# EAGLE design Schematic (EAGLE 7.2.0)
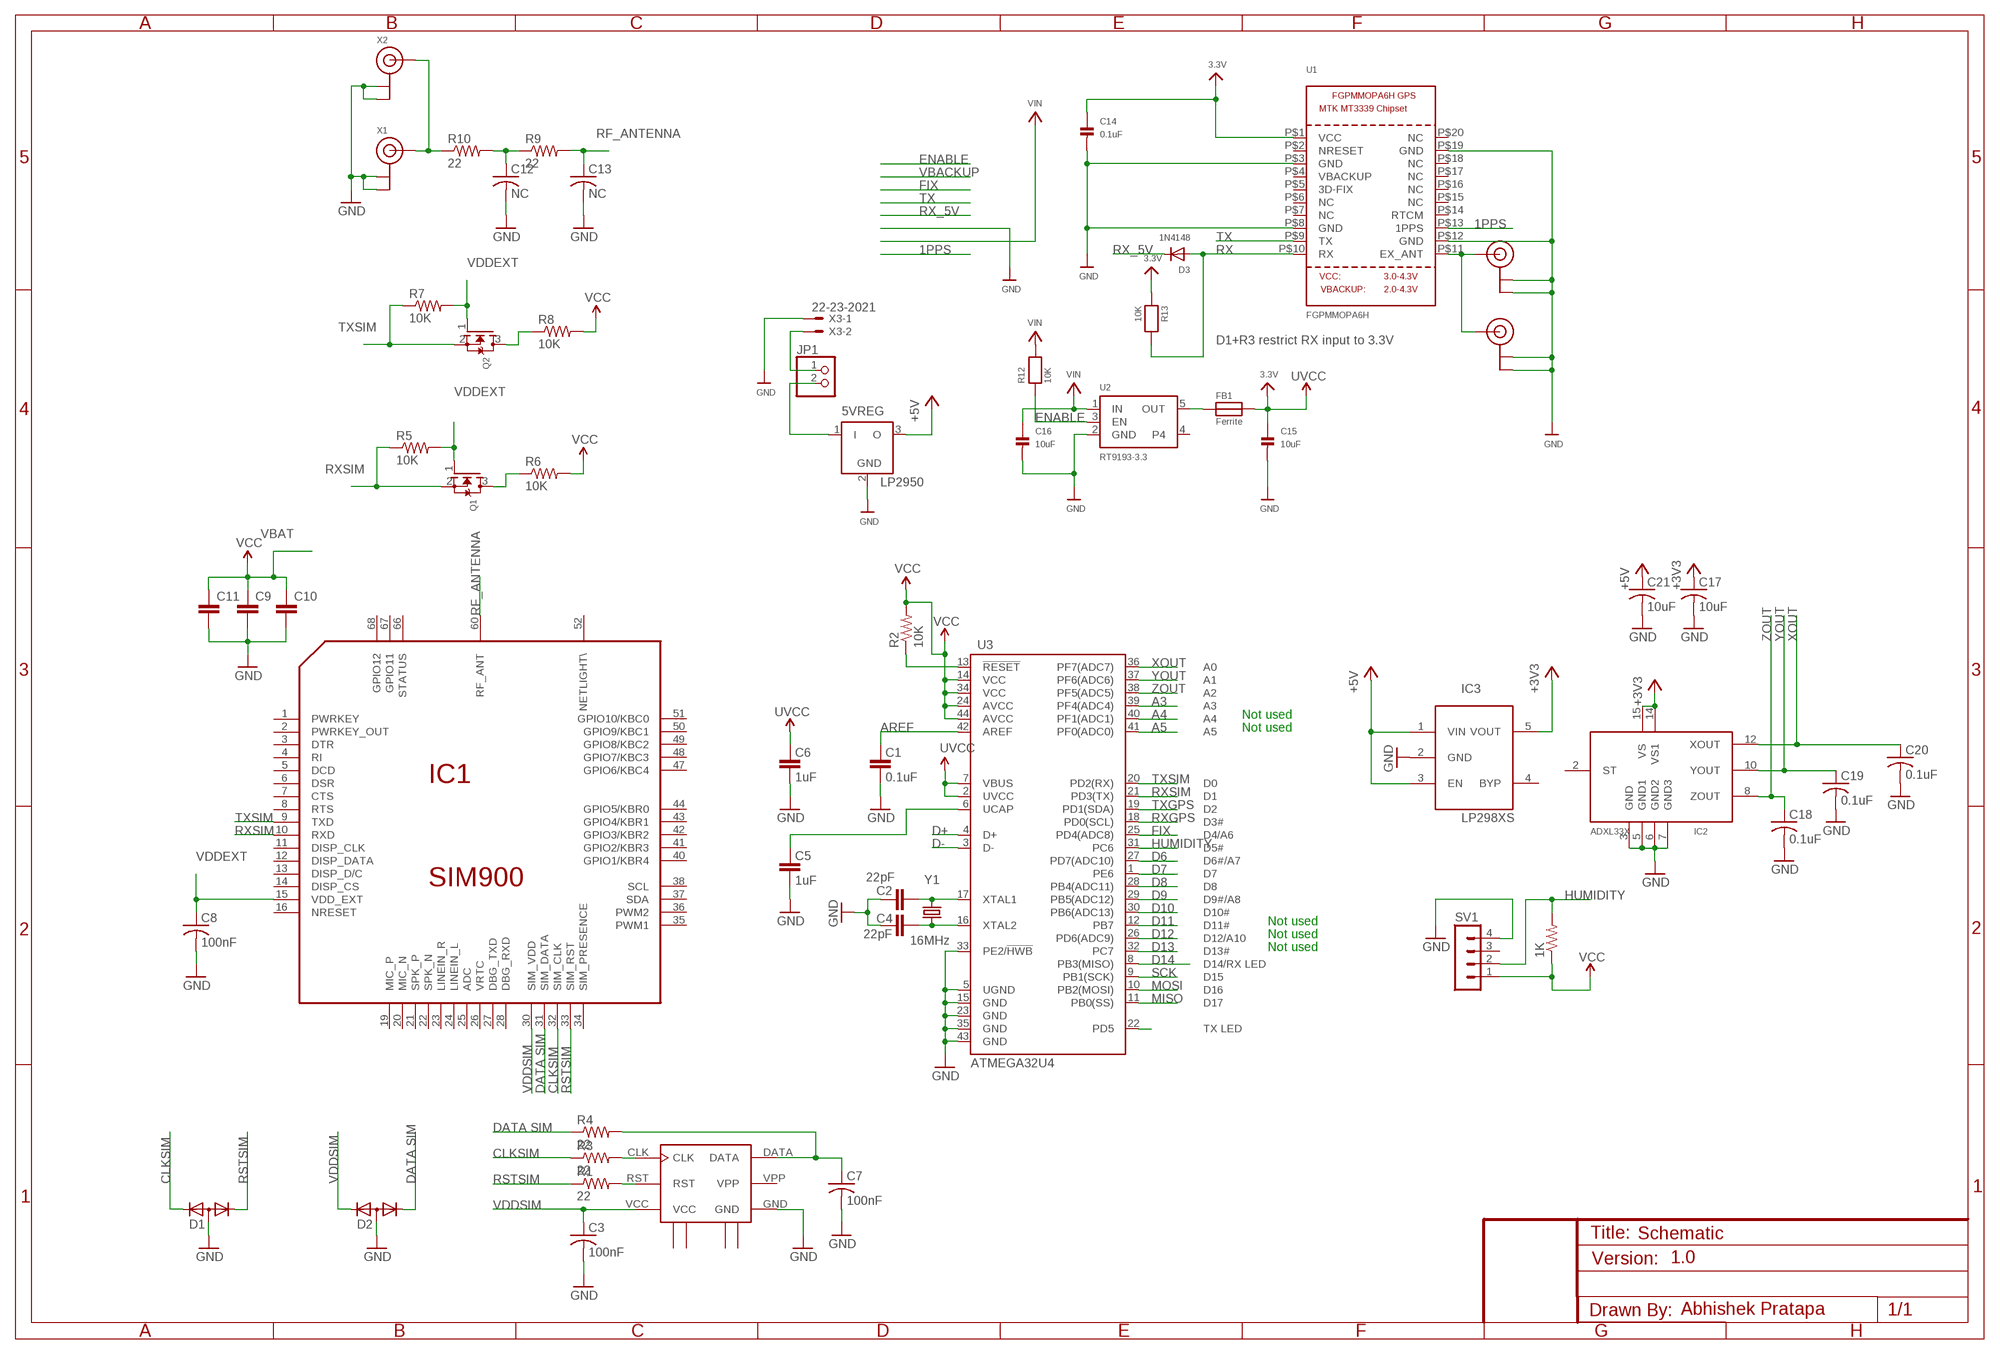
[diagram p0: schematic, sheet 1]

## Parts
1K  R-US_M0805  [M0805]
5VREG  LP2950  [DPACK]
C1  0.1uF  CAP0603-CAP  [0603-CAP]
C2  22pF  CAP0603-CAP  [0603-CAP]
C3  100nF  C-USC0805  [C0805]
C4  22pF  CAP0603-CAP  [0603-CAP]
C5  1uF  CAP0603-CAP  [0603-CAP]
C6  1uF  CAP0603-CAP  [0603-CAP]
C7  100nF  C-USC0805  [C0805]
C8  100nF  C-USC0805  [C0805]
C9  C-EUC0805  [C0805]
C10  C-EUC0805  [C0805]
C11  C-EUC0805  [C0805]
C12  NC  C-USC0805  [C0805]
C13  NC  C-USC0805  [C0805]
C14  0.1uF  CAP_CERAMIC0805  [0805]
C15  10uF  CAP_CERAMIC0805  [0805]
C16  10uF  CAP_CERAMIC0805  [0805]
C17  10uF  C-USC0805K  [C0805K]
C18  0.1uF  C-USC0805K  [C0805K]
C19  0.1uF  C-USC0805K  [C0805K]
C20  0.1uF  C-USC0805K  [C0805K]
C21  10uF  C-USC0805K  [C0805K]
D1  DIODE-2CA|ACSOT23  [SOT23]
D2  DIODE-2CA|ACSOT23  [SOT23]
D3  1N4148  DIODESOD-323F  [SOD-323F]
FB1  Ferrite  FERRITE0805  [0805]
IC1  SIM900  [SIM900]
IC2  ADXL33X  [16LCSP]
IC3  LP298XS  [SOT23-5L]
JP1  PINHD-1X2  [1X02]
Q1  MOSFET-NREFLOW  [SOT23]
Q2  MOSFET-NREFLOW  [SOT23]
R1  22  R-US_M0805  [M0805]
R2  10K  RESISTOR0603-RES  [0603-RES]
R3  22  R-US_M0805  [M0805]
R4  22  R-US_M0805  [M0805]
R5  10K  R-US_M0805  [M0805]
R6  10K  R-US_M0805  [M0805]
R7  10K  R-US_M0805  [M0805]
R8  10K  R-US_M0805  [M0805]
R9  22  R-US_R0805  [R0805]
R10  22  R-US_R0805  [R0805]
R12  10K  RESISTOR0805  [0805]
R13  10K  RESISTOR0805  [0805]
SV1  MA04-1  [MA04-1]
U1  FGPMMOPA6H  GPS_FGPMMOPA6H  [FGPMMOPA6H]
U2  RT9193-3.3  VREG_SOT23-5  [SOT23-5]
U3  ATMEGA32U4  ATMEGA32U4OUTFAKES  [QFN-44-NOPAD_1:1-OUTFAKES]
U$1  SCU-W0822XR-06  [SCU-W0822XR-06]
U$8  U.FL  [U.FL]
U$20  U.FL  [U.FL]
X1  ANTENNA_U.FL  [U.FL]
X2  ANTENNA_U.FL  [U.FL]
X3  22-23-2021  [22-23-2021]
Y1  16MHz  CRYSTAL5X3  [CRYSTAL-SMD-5X3]

## Nets
1PPS: U1.P$13(1PPS)
3.3V: 1K.1 C14.1 C15.1 FB1.2 R13.1 SV1.1 U1.P$1(VCC) ; supply symbol labelled UVCC, VCC
+3V3: C17.1 IC2.14(VS1) IC2.15(VS) IC3.5(VOUT)
+5V: 5VREG.3(O) C21.1 IC3.1(VIN) IC3.3(EN)
A3: U3.39(PF4(ADC4))
A4: U3.40(PF1(ADC1))
A5: U3.41(PF0(ADC0))
AREF: C1.2 U3.42(AREF)
CLKSIM: D1.2(K2) IC1.32(SIM_CLK) R3.1
D6: U3.27(PD7(ADC10))
D7: U3.1(PE6)
D8: U3.28(PB4(ADC11))
D9: U3.29(PB5(ADC12))
D10: U3.30(PB6(ADC13))
D11: U3.12(PB7)
D12: U3.26(PD6(ADC9))
D13: U3.32(PC7)
D14: U3.8(PB3(MISO))
D+: U3.4(D+)
D-: U3.3(D-)
DATASIM: D2.1(K1) IC1.31(SIM_DATA) R4.1
ENABLE: R12.1 U2.3(EN)
FIX: U3.25(PD4(ADC8))
GND [vcc]: 5VREG.2(GND) C1.1 C2.2 C3.2 C4.2 C5.1 C6.1 C7.2 C8.2 C9.2 C10.2 C11.2 C12.2 C13.2 C14.2 C15.2 C16.2 C17.2 C18.2 C19.2 C20.2 C21.2 D1.3(A) D2.3(A) IC2.3(GND) IC2.5(GND1) IC2.6(GND2) IC2.7(GND3) IC3.2(GND) SV1.4 U1.P$3(GND) U1.P$8(GND) U1.P$12(GND) U1.P$19(GND) U2.2(GND) U3.5(UGND) U3.15(GND) U3.23(GND) U3.33(PE2/!HWB) U3.35(GND) U3.43(GND) U$1.GND U$8.P$1(GND) U$8.P$2(GND) U$20.P$1(GND) U$20.P$2(GND) X1.1(GND) X1.2(GND) X2.1(GND) X2.2(GND) X3.1
HUMIDITY: 1K.2 SV1.2 U3.31(PC6)
MISO: U3.11(PB0(SS))
MOSI: U3.10(PB2(MOSI))
N$1: C4.1 U3.16(XTAL2) Y1.1
N$2: C2.1 U3.17(XTAL1) Y1.3
N$3: R1.2 U$1.RST
N$4: C5.2 U3.6(UCAP)
N$5: R3.2 U$1.CLK
N$6: C7.1 R4.2 U$1.DATA
N$7: R10.1 X1.3(SIGNAL) X2.3(SIGNAL)
N$8: C12.1 R9.1 R10.2
N$9: Q1.3(D) R6.1
N$10: Q2.3(D) R8.1
N$11: 5VREG.1(I) JP1.2
N$12: FB1.1 U2.5(OUT)
N$13: U1.P$11(EX_ANT) U$8.P$3(SIGNAL) U$20.P$3(SIGNAL)
N$14: JP1.1 X3.2
RESET: R2.1 U3.13(!RESET)
RF_ANTENNA: C13.1 IC1.60(RF_ANT) R9.2
RSTSIM: D1.1(K1) IC1.33(SIM_RST) R1.1
RX: D3.A R13.2 U1.P$10(RX)
RX_5V: D3.C U3.18(PD0(SCL))
RXSIM: IC1.10(RXD) Q1.2(S) R5.1 U3.21(PD3(TX))
SCK: U3.9(PB1(SCK))
TX: U1.P$9(TX) U3.19(PD1(SDA))
TXLED: U3.22(PD5)
TXSIM: IC1.9(TXD) Q2.2(S) R7.1 U3.20(PD2(RX))
UVCC: C6.2 U3.2(UVCC) U3.7(VBUS)
VCCSIM: C3.1 D2.2(K2) IC1.30(SIM_VDD) U$1.VCC
VDDEXT: C8.1 IC1.15(VDD_EXT) Q1.1(G) Q2.1(G) R5.2 R7.2
VIN: C9.1 C10.1 C11.1 C16.1 R2.2 R6.2 R8.2 R12.2 U2.1(IN) U3.14(VCC) U3.24(AVCC) U3.34(VCC) U3.44(AVCC) ; supply symbol labelled VCC
XOUT: C20.1 IC2.12(XOUT) U3.36(PF7(ADC7))
YOUT: C19.1 IC2.10(YOUT) U3.37(PF6(ADC6))
ZOUT: C18.1 IC2.8(ZOUT) U3.38(PF5(ADC5))
Unconnected: IC1.1(PWRKEY) IC1.2(PWRKEY_OUT) IC1.3(DTR) IC1.4(RI) IC1.5(DCD) IC1.6(DSR) IC1.7(CTS) IC1.8(RTS) IC1.11(DISP_CLK) IC1.12(DISP_DATA) IC1.13(DISP_D/C) IC1.14(DISP_CS) IC1.16(NRESET) IC1.19(MIC_P) IC1.20(MIC_N) IC1.21(SPK_P) IC1.22(SPK_N) IC1.23(LINEIN_R) IC1.24(LINEIN_L) IC1.25(ADC) IC1.26(VRTC) IC1.27(DBG_TXD) IC1.28(DBG_RXD) IC1.34(SIM_PRESENCE) IC1.35(PWM1) IC1.36(PWM2) IC1.37(SDA) IC1.38(SCL) IC1.40(GPIO1/KBR4) IC1.41(GPIO2/KBR3) IC1.42(GPIO3/KBR2) IC1.43(GPIO4/KBR1) IC1.44(GPIO5/KBR0) IC1.47(GPIO6/KBC4) IC1.48(GPIO7/KBC3) IC1.49(GPIO8/KBC2) IC1.50(GPIO9/KBC1) IC1.51(GPIO10/KBC0) IC1.52(NETLIGHT\) IC1.66(STATUS) IC1.67(GPIO11) IC1.68(GPIO12) IC2.2(ST) IC3.4(BYP) SV1.3 U1.P$2(NRESET) U1.P$4(VBACKUP) U1.P$5(3D-FIX) U1.P$6(NC) U1.P$7(NC) U1.P$14(RTCM) U1.P$15(NC) U1.P$16(NC) U1.P$17(NC) U1.P$18(NC) U1.P$20(NC) U2.4

## Notes on the sheet
- D1+R3 restrict RX input to 3.3V
- VBAT
- Not used
- Not used
- TXGPS
- RXGPS
- Not used
- Not used
- Not used
- VDDSIM | DATA SIM | CLKSIM | RSTSIM
- DATA SIM
- CLKSIM
- CLKSIM | RSTSIM | VDDSIM | DATA SIM | RSTSIM
- VDDSIM
- 1.0
- Abhishek Pratapa

## Power pins joined to a net without a drawn wire
GND: IC1.17(GND) IC1.18(GND) IC1.29(GND) IC1.39(GND) IC1.45(GND) IC1.46(GND) IC1.53(GND) IC1.54(GND) IC1.58(GND) IC1.59(GND) IC1.61(GND) IC1.62(GND) IC1.63(GND) IC1.64(GND) IC1.65(GND) U$1.GND_1(GND1) U$1.GND_2(GND2) U$1.GND_3(GND3)
GND4: U$1.GND_4(GND4)
VBAT: IC1.55(VBAT) IC1.56(VBAT) IC1.57(VBAT)
VPP: U$1.VPP

## Library data of the parts
1K R1 R3-R10 = adafruit:R-US_: RESISTOR, American symbol
5VREG = linear:LP2950: 100 mA, Low Power Low Dropout Voltage Regulator Source: http://www.onsemi.com/pub/Collateral/LP2950-D.PDF
C1 C2 C4-C6 = SparkFun:CAP: Capacitor Standard 0603 ceramic capacitor, and 0.1" leaded capacitor.
C3 C7 C8 C12 C13 C17-C21 = adafruit:C-US: CAPACITOR, American symbol
C9-C11 = rcl:C-EU: CAPACITOR, European symbol
C14-C16 = microbuilder:CAP_CERAMIC: Ceramic Capacitors 0402 - 0402 Surface Mount Capacitors 16pF 50V 5% [Digikey: 445-4899-2-ND] 18pF 50V 5% [Digikey: 490-1281-2-ND] 22pF 50V 5% [Digikey: 490-1283-2-ND] 68pF 50V 5% [Digikey: 490-1289-2-ND] 0.1uF 10V 10% [Digikey: 490-1318-2-ND] 1.0uF 6.3V 10% [Digikey: 490-1320-2-ND] 0603 - 0603 Surface Mount Capacitors 16 pF 50V 5% [Digikey: 445-5051-2-ND] 22 pF 50V [Digikey: PCC220ACVTR-ND] 33 pF 50V 5% [Digikey: 490-1415-1-ND] 56pF 50V 5% [Digikey: 490-1421-1-ND] 220pF 50V 5% [Digikey: 445-1285-1-ND] 680 pF 50V 2200 pF 50V 5% C0G [Digikey: 445-1297-1-ND] 5600 pF 100V 5% X7R [Digikey: 478-3711-1-ND] 0.1 µF 25V 10% [Digikey: PCC2277TR-ND] 0.22 µF 16V 10% X7R [Digikey: 445-1318-1-ND] 1.0 µF 25V 10% [Digikey: 445-5146-2-ND] 0603 - RF Specific 3pF 250V +/-0.1pF RF [Digikey: 712-1347-1-ND] 18 pF 250V 5% [Digikey: 478-3505-1-ND or 712-1322-1-ND] 56 pF 250V 5% C0G RF [Digikey: 490-4867-1-ND] 68 pF 250V RF [Digikey: 490-4868-1-ND] 0805 - 0805 Surface Mount Capacitors 220 pF 250V 2% RF Ceramic Capacitor [Digikey: 712-1398-1-ND] 1000 pF 50V 2% NP0 Ceramic Capacitor [Digikey: 478-3760-1-ND] 0.1 µF 25V 10% Ceramic Capacitor [Digikey: PCC1828TR-ND] 1.0 µF 16V 10% Ceramic Capacitor[Digikey: 490-1691-2-ND] 10.0 µF 10V 10% Ceramic Capacitor[Digikey: 709-1228-1-ND] 10.0 uF 16V 10% Ceramic Capacitor [Digikey: 478-5165-2-ND] 47 uF 6.3V 20% Ceramic Capacitor [Digikey: 587-1779-1-ND or 399-5506-1-ND] 1206 - 1206 Surface Mount Capacitors 47uF 10V 20% Ceramic Capacitor [Digikey: 490-5528-1-ND or 399-5508-1-ND or 445-6010-1-ND] 100uF 6.3V -20%, +80% Y5V Ceramic Capacitor (Digikey: 490-4512-1-ND, Mouser: 81-GRM31CF50J107ZE1L)
D1 D2 = diode:DIODE-2CA|AC: Dual DIODE Cathode-Anode|Anode-Cathode
D3 = adafruit:DIODE: Diode SMADIODE - SMA Surface Mount Package 20V 1A Schottky Diode Digikey: 641-1014-6-ND DO-1N4148 - Through Hole Small Current Diode SOD-123 20V 1 A (.5mV Vf) Schottky Diode - Digikey: MBRX120TPMSCT-ND SOD-323 10V 570mA (.38mV Vf, 3ns) Schottky Diode - Digikey: ZLLS410CT-ND SOD-523 30V 30mA Schottky Diode (RB751S-40TE61) - Digikey: RB751S-40TE61CT-ND SOT23-R/W - SOT23 Package (R = Solder Paste/Reflow Ovens, W = Hand-Soldering) BAT54Film 40V 300mA - Digikey: 497-7162-1-ND
FB1 = microbuilder:FERRITE: Ferrite Bead 0603 MMZ1608B121C - 120 Ohm, 600mA Ferrite Chip - Digikey: 445-2164-1-ND BK1608HW121-T - 120 Ohm, 600mA Ferrite Chip - Digikey: 587-1876-2-ND
IC1 = sim900:SIM900
IC2 = adafruit:ADXL33X
IC3 = adafruit:LP298X
JP1 = pinhead:PINHD-1X2: PIN HEADER
Q1 Q2 = adafruit:MOSFET-N: N-Channel Mosfet 2N7002E - 60V 260mA SOT23 [Digikey: 2N7002ET1GOSTR-ND] - REEL BSH103 - 30V 850mA SOT23 [Digikey: 568-5013-1-ND]
R2 = SparkFun:RESISTOR: Resistor Basic schematic elements and footprints for 0603, 1206, and PTH resistors.
R12 R13 = microbuilder:RESISTOR: Resistors 0402 - 0402 Surface Mount Package 22 Ohm 1% 1/16W [Digikey: 311-22.0LRTR-ND] 33 Ohm 5% 1/16W 1.0K 5% 1/16W 1.5K 5% 1/16W 2.0K 1% 1/16W 10.0K 1% 1/16W [Digikey: 311-10.0KLRTR-ND] 10.0K 5% 1/16W [Digikey: RMCF0402JT10K0TR-ND] 12.1K 1% 1/16W [Digikey: 311-22.0LRTR-ND] 100.0K 5% 1/16W 0603 - 0603 Surface Mount Package 0 Ohm 1/10 Watt 1% Resistor 15 Ohm 1/10 Watt 1% Resistor 33 Ohm 1/10 Watt 1% Resistor 49.9 Ohm 1/10 Watt 1% Resistor 100 Ohm 1/10 Watt 1% Resistor 150 Ohm 1/10 Watt 1% Resistor 240 Ohm 1/10 Watt 1% Resistor 390 Ohm 1/10 Watt 1% Resistor 560 Ohm 1/10 Watt 1% Resistor 680 Ohm 1/10 Watt 1% Resistor 750 Ohm 1/10 Watt 1% Resistor 1.0K Ohm 1/10 Watt 1% Resistor 1.5K Ohm 1/10 Watt 1% Resistor 2.0K Ohm 1/10 Watt 1% Resistor 2.2K Ohm 1/10 Watt 1% Resistor 3.3K Ohm 1/10 Watt 1% Resistor 4.7K Ohm 1/10 Watt 1% Resistor 10.0K Ohm 1/10 Watt 1% Resistor 12.0K Ohm 1/10 Watt 1% Resistor 12.1K Ohm 1/10 Watt 1% Resistor 20.0K Ohm 1/10 Watt 1% Resistor 33.0K Ohm 1/10 Watt 1% Resistor 100.0K Ohm 1/10 Watt 1% Resistor 0805 - 0805 Surface Mount Package 0 Ohm 1/8 Watt 1% Resistor 33 Ohm 1/8 Watt 1% Resistor 100 Ohm 1/8 Watt 1% Resistor 150 Ohm 1/8 Watt 1% Resistor 200 Ohm 1/8 Watt 1% Resistor 240 Ohm 1/8 Watt 1% Resistor 330 Ohm 1/8 Watt 1% Resistor 390 Ohm 1/8 Watt 1% Resistor 470 Ohm 1/8 Watt 1% Resistor 1.0K Ohm 1/8 Watt 1% Resistor 1.5K Ohm 1/8 Watt 1% Resistor 2.0K Ohm 1/8 Watt 1% Resistor 4.7K Ohm 1/8 Watt 1% Resistor 5.1K Ohm 1/8 Watt 1% Resistor 5.6K Ohm 1/8 Watt 1% Resistor 10.0K Ohm 1/8 Watt 1% Resistor 22.0K Ohm 1/8 Watt 1% Resistor 33.0K Ohm 1/8 Watt 1% Resistor 100K Ohm 1/8 Watt 1% Resistor 1206 - 1206 Surface Mount Package 2012 - 2010 Surface Mount Package 0.11 Ohm 1/2 Watt 1% Resistor - Digikey: RHM.11UCT-ND
SV1 = con-lstb:MA04-1: PIN HEADER; OC_FARNELL: unknown; OC_NEWARK: unknown
U1 = microbuilder:GPS_FGPMMOPA6H: GPS Module - MTK MT3339 Chipset, -165dBm sensitivity, 22 channels, 10Hz, auto-select external antenna options
U2 = microbuilder:VREG_SOT23-5: SOT23-5 Fixed Voltage Regulators To better organise some of the SOT23-5 fixed voltage regulators in this library, this new part was created. Part Current Out V Out V In V Dropout Digikey Part No. ADP121 150mA 3.3V 3.4-5.5V 0.09V @ 150mA ADP121-AUJZ33R7CT-ND ADP121 150mA 3.0V 3.1-5.5V 0.09V @ 150mA ADP121-AUJZ30R7CT-ND ADP122 300mA 3.3V 3.4-5.5V 0.085V @ 300mA ADP122AUJZ-3.3-R7CT-ND ADP1712 300mA 3.3V 3.5-5.5V 0.17V @ 300mA ADP1712AUJZ-3.3-R7TR-ND AP7311 (Low Cost) 150mA 3.3V 3.5-6V 0.15V @ 150mA AP7311-33WG-7DICT-ND LD39015M18R 150mA 1.8V 1.9V-5.5V 0.08V @ 100mA 497-6977-1-ND MCP1824T-3302E/OT 300mA 3.3V 3.5V-6V 0.2V @ 300mA MCP1824T-3302E/OTCT-ND MIC5205-2.5YM5 TR 150mA 2.5V 2.7-16V 0.165V @ 150mA 576-1257-2-ND MIC5205-3.0YM5 TR 150mA 3.0V 3.2V-16V 0.165V @ 150mA 576-1258-2-ND MIC5205-3.3YM5 TR 150mA 3.3V 3.5V-16V 0.165V @ 150mA 576-1259-2-ND TPS780330220 150mA 3.3V+2.2V 3.6-5.5V 250mV Max 296-23332-1-ND TDA3663/N1,135 100mA 3.3V 3.5-45V 0.18V @ 50mA 568-5343-1-ND
U3 = Testing:ATMEGA32U4: Atmel 44-pin 8-bit Microcontroller with 32KBytes of ISP Flash and USB Controller
U$1 = con-sim:SCU-W0822XR-06
U$8 U$20 = microbuilder:U.FL: U.FL Antenna Connector
X1 X2 = adafruit:ANTENNA_U.FL: U.FL Antenna Connector
X3 = con-molex:22-23-2021: .100" (2.54mm) Center Header - 2 Pin; MF: MOLEX; MPN: 22-23-2021; OC_FARNELL: 1462926; OC_NEWARK: 25C3832
Y1 = SparkFun:CRYSTAL: Crystals Various standard crystals. Proven footprints. Spark Fun Electronics SKU : COM-00534

## Board
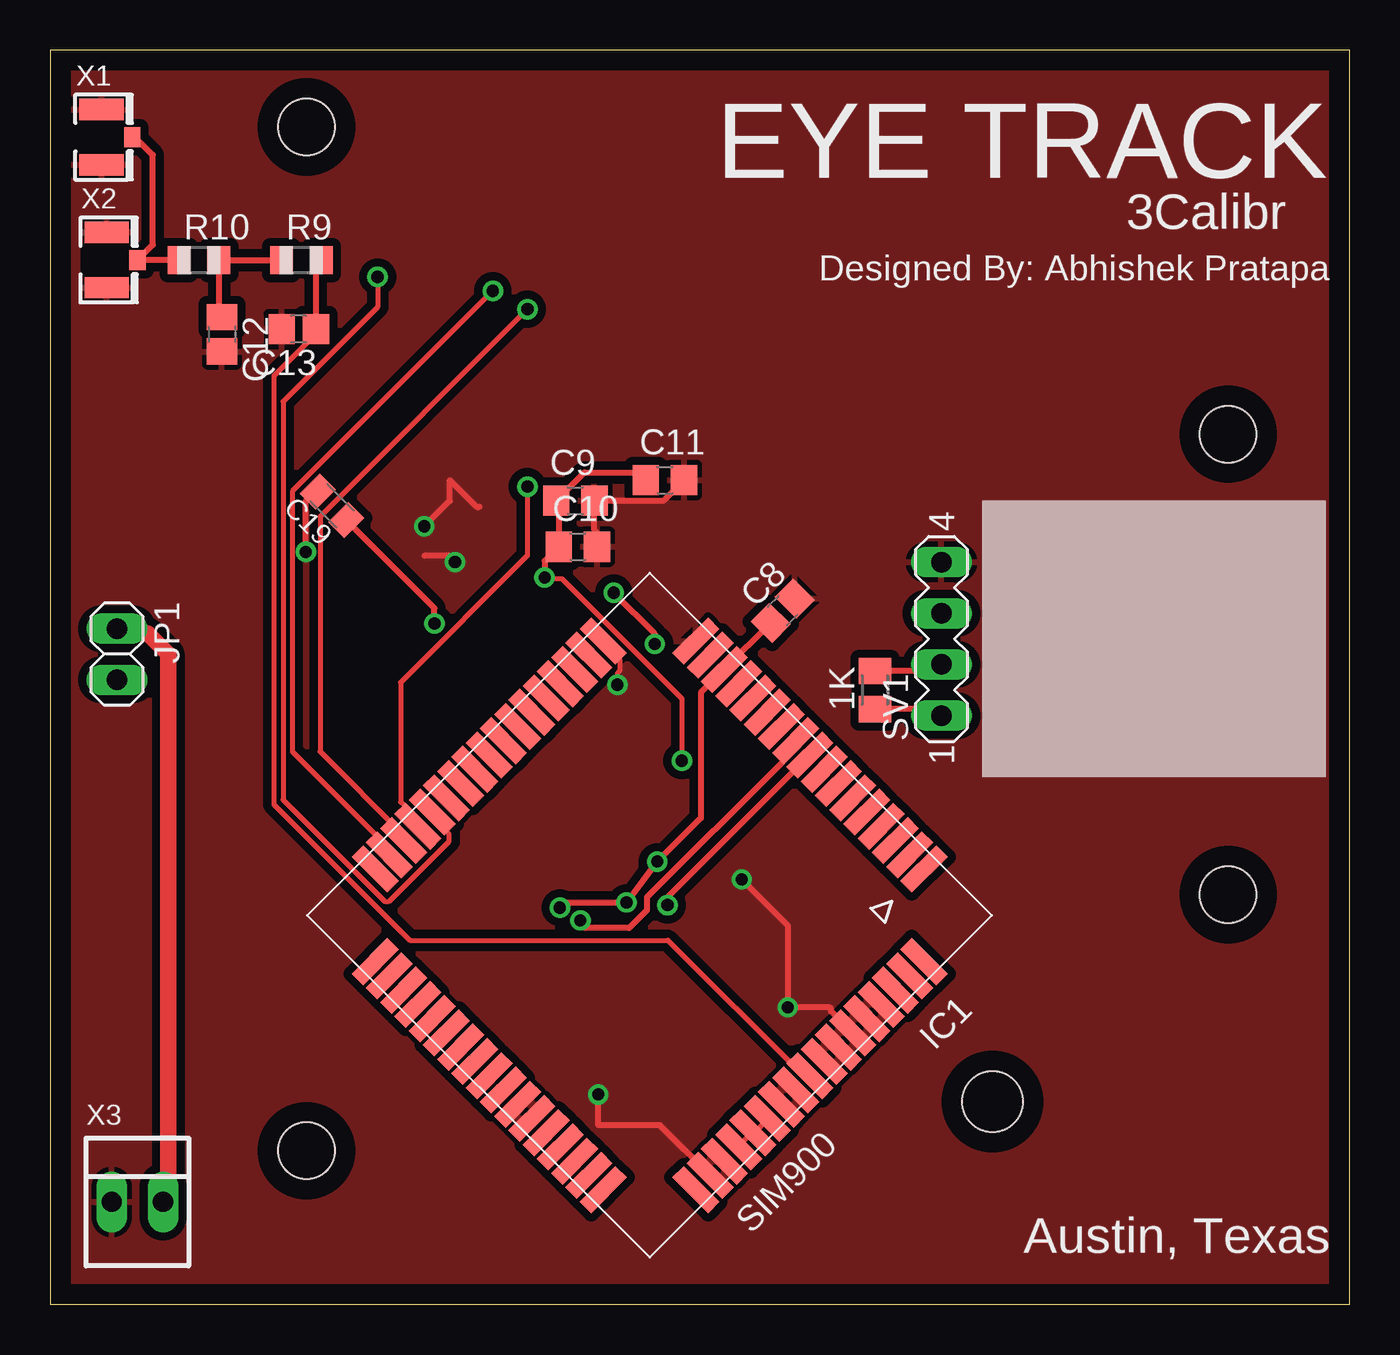
[diagram p1: board, top side]
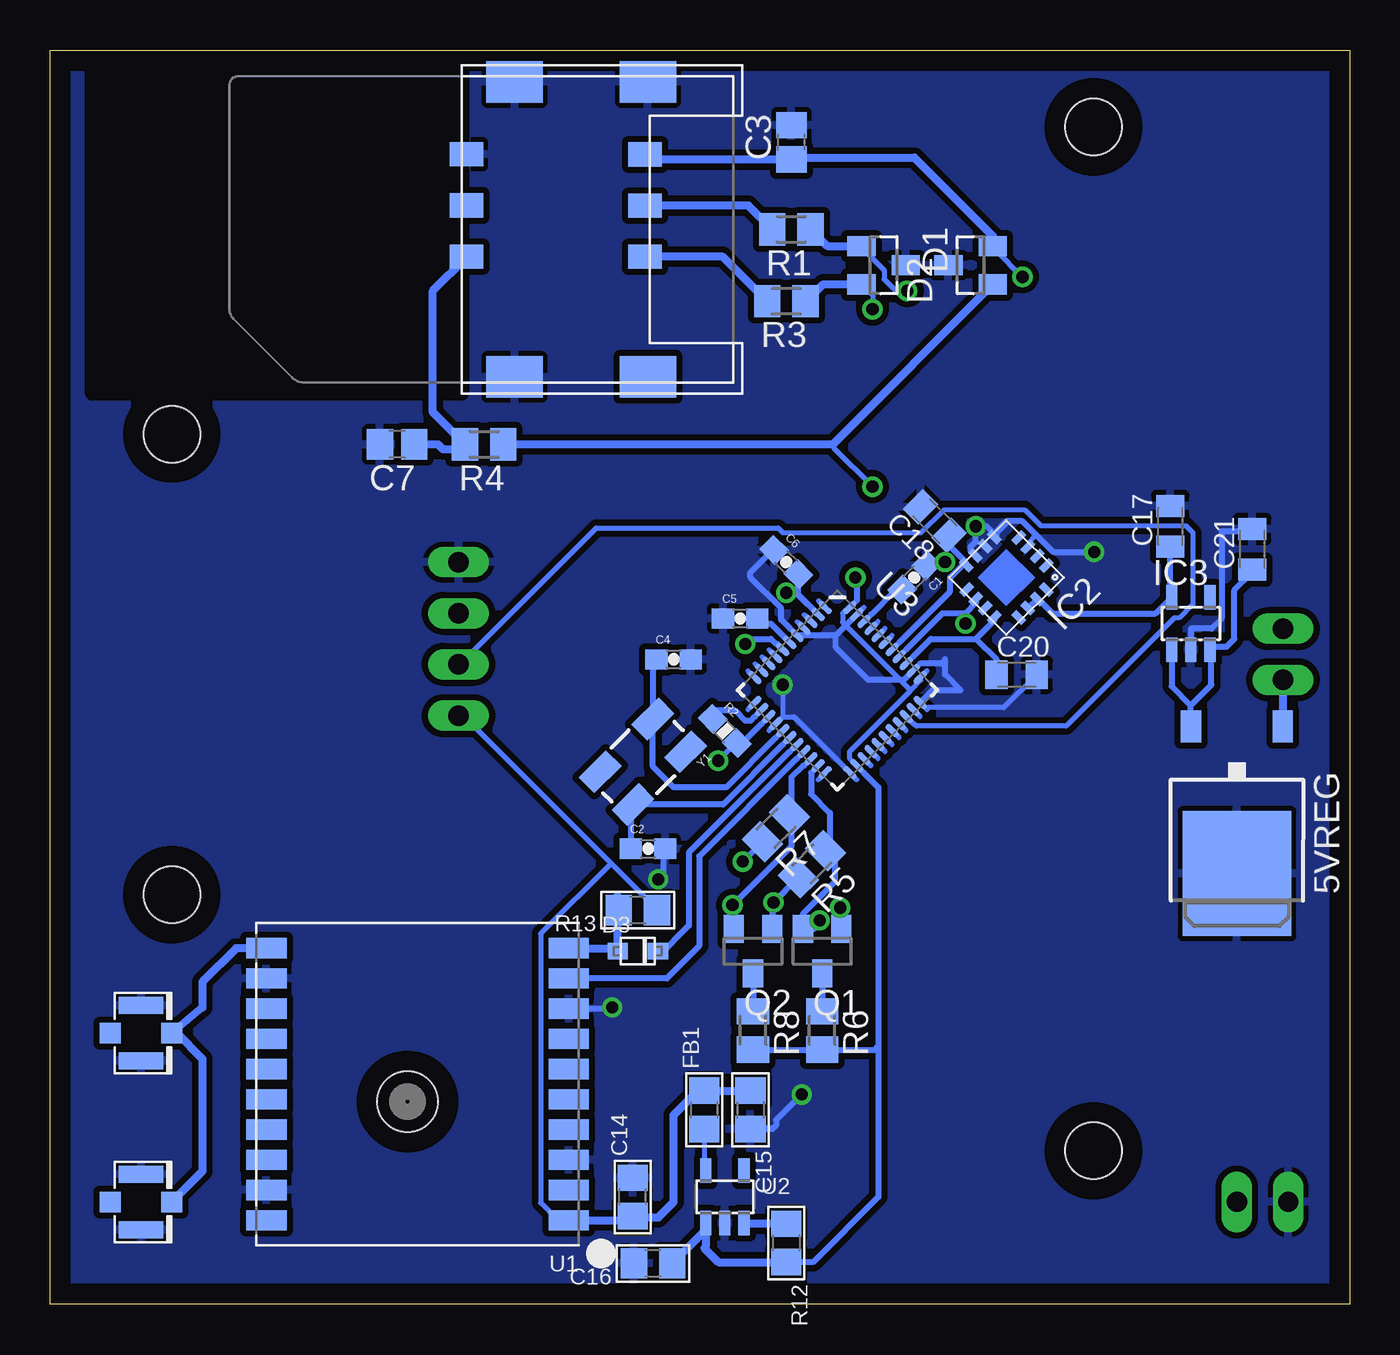
[diagram p2: board, bottom side, seen from below]

Size 64.44 x 62.22 mm. Coordinates in mm from the lower left corner, seen from the top.
Outline: 0,0 64.44,0 64.44,62.22 0,62.22 0,0
Copper layers (1*16): Top 0.035mm / dielectric 1.5mm / Bottom 0.035mm
Design rules "default": minimum track width 10mil, minimum drill 24mil, track to track 8mil, track to pad 8mil, pad to pad 8mil, via to via 8mil, smd to smd 8mil, copper to edge 40mil, drill to drill 8mil, minimum pad ring 10mil, minimum via ring 8mil, stop-mask expansion 4mil, vias tented up to drill 0mil, thermal gap 10mil
Holes 2.8 mm at 12.7,7.62 12.7,58.42 58.42,20.32 58.42,43.18

### Footprints (pad centres in the part's own frame; a part is rotated, then mirrored left to right if it is on the bottom)
M0805 = smd 1.3 x 1.6: 1 -0.95,0; 2 0.95,0
DPACK = smd 1 x 1.6: 1 -2.28,-4.8; 3 2.28,-4.8 | smd 5.4 x 6.2: 2 0,2.5
0603-CAP = smd 1.1 x 1: 1 -0.85,0; 2 0.85,0
C0805 = smd 1.3 x 1.5: 1 -0.85,0; 2 0.85,0
C0805' = smd 1.3 x 1.5: 1 -0.95,0; 2 0.95,0
0805 = smd 1.3 x 1.5: 1 -0.95,0; 2 0.95,0
C0805K = smd 1.1 x 1.4: 1 -1,0; 2 1,0
SOT23 = smd 1 x 1.4: 1 -0.95,-1.1; 2 0.95,-1.1; 3 0,1.1
SOD-323F = smd 1 x 0.8: A -1,0; C 1,0
SIM900 = smd 2.5 x 0.8: 1 -11.25,8; 2 -11.25,7; 3 -11.25,6; 4 -11.25,5; 5 -11.25,4; 6 -11.25,3; 7 -11.25,2; 8 -11.25,1; 9 -11.25,0; 10 -11.25,-1; 11 -11.25,-2; 12 -11.25,-3; 13 -11.25,-4; 14 -11.25,-5; 15 -11.25,-6; 16 -11.25,-7; 17 -11.25,-8; 35 11.25,-8; 36 11.25,-7; 37 11.25,-6; 38 11.25,-5; 39 11.25,-4; 40 11.25,-3; 41 11.25,-2; 42 11.25,-1; 43 11.25,0; 44 11.25,1; 45 11.25,2; 46 11.25,3; 47 11.25,4; 48 11.25,5; 49 11.25,6; 50 11.25,7; 51 11.25,8 | smd 0.8 x 2.5: 18 -8,-11.25; 19 -7,-11.25; 20 -6,-11.25; 21 -5,-11.25; 22 -4,-11.25; 23 -3,-11.25; 24 -2,-11.25; 25 -1,-11.25; 26 0,-11.25; 27 1,-11.25; 28 2,-11.25; 29 3,-11.25; 30 4,-11.25; 31 5,-11.25; 32 6,-11.25; 33 7,-11.25; 34 8,-11.25; 52 8,11.25; 53 7,11.25; 54 6,11.25; 55 5,11.25; 56 4,11.25; 57 3,11.25; 58 2,11.25; 59 1,11.25; 60 0,11.25; 61 -1,11.25; 62 -2,11.25; 63 -3,11.25; 64 -4,11.25; 65 -5,11.25; 66 -6,11.25; 67 -7,11.25; 68 -8,11.25
16LCSP = smd 0.7 x 0.35: 1 -1.825,0.975; 2 -1.825,0.325; 3 -1.825,-0.325; 4 -1.825,-0.975; 9 1.825,-0.975; 10 1.825,-0.325; 11 1.825,0.325; 12 1.825,0.975 | smd 0.35 x 0.7: 5 -0.975,-1.85; 6 -0.35,-1.85; 7 0.325,-1.85; 8 0.975,-1.85; 13 0.975,1.825; 14 0.325,1.825; 15 -0.325,1.825; 16 -0.975,1.825
SOT23-5L = smd 0.55 x 1.2: 1 -0.95,-1.3; 2 0,-1.3; 3 0.95,-1.3; 4 0.95,1.3; 5 -0.95,1.3
1X02 = drill 1.016 long: 1 -1.27,0; 2 1.27,0
0603-RES = smd 1.1 x 1: 1 -0.85,0; 2 0.85,0
R0805 = smd 1.1 x 1.4: 1 -1,0; 2 1,0
MA04-1 = drill 1.016 long: 1 -3.81,0; 2 -1.27,0; 3 1.27,0; 4 3.81,0
FGPMMOPA6H = smd 2 x 1: P$1 -7.5,6.75; P$2 -7.5,5.25; P$3 -7.5,3.75; P$4 -7.5,2.25; P$5 -7.5,0.75; P$6 -7.5,-0.75; P$7 -7.5,-2.25; P$8 -7.5,-3.75; P$9 -7.5,-5.25; P$10 -7.5,-6.75; P$11 7.5,-6.75; P$12 7.5,-5.25; P$13 7.5,-3.75; P$14 7.5,-2.25; P$15 7.5,-0.75; P$16 7.5,0.75; P$17 7.5,2.25; P$18 7.5,3.75; P$19 7.5,5.25; P$20 7.5,6.75 | hole 3: 0.5,0.85
SOT23-5 = smd 0.55 x 1.2: 1 -0.95,-1.3; 2 0,-1.3; 3 0.95,-1.3; 4 0.95,1.3; 5 -0.95,1.3
QFN-44-NOPAD_1:1-OUTFAKES = smd 0.8 x 0.3: 1 -3.337,2.465; 2 -3.337,1.972; 3 -3.337,1.479; 4 -3.337,0.986; 5 -3.337,0.493; 6 -3.337,0; 7 -3.337,-0.493; 8 -3.337,-0.986; 9 -3.337,-1.479; 10 -3.337,-1.972; 11 -3.337,-2.465; 23 3.337,-2.465; 24 3.337,-1.972; 25 3.337,-1.479; 26 3.337,-0.986; 27 3.337,-0.493; 28 3.337,0; 29 3.337,0.493; 30 3.337,0.986; 31 3.337,1.479; 32 3.337,1.972; 33 3.337,2.465 | smd 0.3 x 0.8: 12 -2.465,-3.337; 13 -1.972,-3.337; 14 -1.479,-3.337; 15 -0.986,-3.337; 16 -0.493,-3.337; 17 0,-3.337; 18 0.493,-3.337; 19 0.986,-3.337; 20 1.479,-3.337; 21 1.972,-3.337; 22 2.465,-3.337; 34 2.465,3.337; 35 1.972,3.337; 36 1.479,3.337; 37 0.986,3.337; 38 0.493,3.337; 39 0,3.337; 40 -0.493,3.337; 41 -0.986,3.337; 42 -1.479,3.337; 43 -1.972,3.337; 44 -2.465,3.337
SCU-W0822XR-06 = smd 1.65 x 1.2: CLK -4.42,1.36; DATA 4.43,1.35; GND 4.43,-3.73; RST -4.42,-1.18; VCC -4.42,-3.72; VPP 4.43,-1.19 | smd 2.8 x 2.05: GND_1 2.05,-7.32; GND_2 -4.57,-7.32; GND_3 2.05,7.32; GND_4 -4.57,7.32
U.FL = smd 2.2 x 0.85: P$1 0,1.375; P$2 0,-1.375 | smd 1.05 x 1: P$3 1.525,0; P$4 -1.525,0
U.FL' = smd 2.2 x 1.05: 1 0,1.375; 2 0,-1.375 | smd 0.8 x 1: 3 1.525,0
22-23-2021 = drill 1 long: 1 -1.27,0; 2 1.27,0
CRYSTAL-SMD-5X3 = smd 1.9 x 1.1: 1 -1.85,-1.15; 2 1.85,-1.15; 3 1.85,1.15; 4 -1.85,1.15

### Placement (x,y rotation side)
1K  40.89,30.48 90 top
5VREG  5.59,23.88 180 bottom
C1  21.59,36.07 225 bottom
C2  34.8,22.61 0 bottom
C3  27.69,57.66 90 bottom
C4  33.53,32 0 bottom
C5  30.23,34.04 0 bottom
C6  27.94,36.83 315 bottom
C7  47.24,42.67 180 bottom
C8  36.32,34.42 45 top
C9  [C0805']  26.04,39.88 0 top
C10  [C0805']  26.16,37.59 0 top
C11  [C0805']  30.48,40.89 0 top
C12  8.51,48.13 270 top
C13  12.32,48.39 180 top
C14  35.56,5.33 90 bottom
C15  29.72,9.65 270 bottom
C16  34.54,2.03 180 bottom
C17  8.89,38.61 90 bottom
C18  20.57,38.86 135 bottom
C19  13.97,39.62 135 top
C20  16.51,31.24 0 bottom
C21  4.83,37.47 90 bottom
D1  23.11,51.56 270 bottom
D2  18.8,51.56 90 bottom
D3  35.31,17.53 0 bottom
FB1  32,9.65 90 bottom
IC1  29.72,19.3 225 top
IC2  17.02,36.07 225 bottom
IC3  7.87,33.78 0 bottom
JP1  3.3,32.26 270 top
Q1  26.16,17.53 180 bottom
Q2  29.59,17.53 180 bottom
R1  27.69,53.34 180 bottom
R2  30.99,28.45 315 bottom
R3  27.94,49.78 180 bottom
R4  42.93,42.67 180 bottom
R5  26.67,21.84 225 bottom
R6  26.16,13.59 270 bottom
R7  28.45,23.62 225 bottom
R8  29.59,13.59 270 bottom
R9  12.45,51.82 0 top
R10  7.37,51.82 0 top
R12  27.94,3.05 270 bottom
R13  35.31,19.56 180 bottom
SV1  44.2,33.02 90 top
U1  46.23,10.92 180 bottom
U2  30.99,5.33 0 bottom
U3  25.4,30.48 315 bottom
U$1  39.37,53.34 180 bottom
U$8  59.94,13.46 0 bottom
U$20  59.94,5.08 0 bottom
X1  [U.FL']  2.54,57.91 0 top
X2  [U.FL']  2.79,51.82 0 top
X3  4.32,5.08 0 top
Y1  35.05,26.92 225 bottom

### Tracks (layer width: path | path; a pad name or v marks a point on that pad's centre or on a via)
3.3V
  Top 0.305: SV1.1 43.88,29.53 1K.1
  Bottom 0.254: 36.63,21.89 43.89,29.15 44.12,29.15 SV1.1 | 36.63,21.89 34.4,19.66 R13.1 | 36.63,21.89 40.12,18.4 40.12,5.03 39.32,4.23 38.86,4.23 U1.P$1
  Bottom 0.406: U1.P$1 35.77,4.17 C14.1 35.49,4.32 34.29,4.32 33.53,5.08 33.53,9.4 32.32,10.6 FB1.2 C15.1
+3V3
  Bottom 0.305: IC2.14 IC2.15 15.45,35.01 14.73,34.29 9.62,34.29 IC3.5 8.89,35.15 C17.1
+5V
  Bottom 0.305: 5VREG.3 7.87,29.72 | 7.87,29.72 6.86,30.73 6.86,32.42 IC3.3 6.77,32.64 6.1,32.64 5.71,33.02 5.71,35.43 4.83,36.32 C21.1 | IC3.1 8.82,30.68 7.87,29.72
AREF
  Bottom 0.305: 23.74,34.23 22.5,35.47 C1.2
CLKSIM  (via drill 0.61)
  Top 0.254: v23.66,49.38 13.37,39.09 13.37,27.43 17.49,23.32 17.49,23.09 IC1.32
  Bottom 0.254: v23.66,49.38 23.66,50.06 24.12,50.52 D1.2
  Bottom 0.406: R3.1 27.18,49.6 27.18,49.53 26.1,50.61 D1.2
DATASIM  (via drill 0.61)
  Top 0.254: v23.66,40.58 23.66,37.15 17.37,30.86 17.37,24.92 18.17,24.12 18.17,23.77 IC1.31
  Bottom 0.254: v23.66,40.58 25.6,42.52 25.64,42.67
  Bottom 0.406: D2.1 25.64,42.67 R4.1
ENABLE
  Bottom 0.406: R12.1 30,4 U2.3
GND  (via drill 0.6, 0.61)
  Top 0.254: v28.12,30.75 28.12,31.32 28.23,31.43 28.23,32 27.43,32.8 IC1.18
  Top 0.305: C10.2 27.18,37.66 27.18,38.23 26.98,38.42 C9.2 30.41,39.88 C11.2 | v18.54,38.61 19.81,39.88 19.81,40.89 21.14,39.57 C18.2 | v20.07,36.83 19.75,37.15 IC2.7 | IC1.53 30.23,8.89 27.18,8.89 v27.18,10.41 | IC1.63 38.73,14.54 U1.P$8 38.67,14.73 v36.58,14.73 36.58,18.8 v34.29,21.08 | v12.68,37.34 12.68,39.88 13.15,40.33 C19.2
  Bottom 0.254: 28.12,29.15 27.55,29.15 24.8,26.4 U3.23 | 28.12,29.15 28.35,28.92 U3.15 | 15.66,38.29 15.66,38.06 15.89,37.83 15.89,37.6 IC2.3 | 16.26,38.86 16.92,38.86 17.6,38.18 IC2.5 | 20.95,29.52 20.92,29.6 17.14,29.6 15.54,31.2 C20.2 | v28.12,30.75 28.12,29.15
  Bottom 0.305: C21.2 4.94,38.35 6.35,38.35 6.35,34.04 6.86,33.53 7.87,33.53 IC3.2 | v18.54,38.61 18.54,37.85 18.8,37.59 18.8,37.39 IC2.7 18.54,37.13 18.54,37.08 | C1.1 20.83,36.83 v20.07,36.83 | v27.18,10.41 28.45,9.14 28.45,8.89 28.64,8.7 C15.2 | v36.58,14.73 36.32,14.73 36.38,14.67 U1.P$8 | C2.2 34.04,22.52 34.04,21.34 v34.29,21.08 | U3.33 20.68,30.48 19.3,30.48 20.07,31.24 20.07,32 20.28,31.79 21.3,31.79 | 27.75,33.52 28.19,33.97 28.19,34.54 29.72,36.07 29.72,36.32 28.61,37.43 C6.1 | U3.43 25.48,33.19 | 25.48,33.19 U3.5 | U3.35 22.1,30.99 23.88,30.99 25.48,32.59 25.48,33.19 | v18.54,38.61 18.03,38.61 17.53,38.1 17.53,38.35 17.02,38.86 16.26,38.86 16.23,38.86 15.66,38.29 14.71,37.34 v12.68,37.34 | 18.8,38.61 v18.54,38.61
  pour Bottom (isolate 0.305): 0,0 0,60.96 0,63.5 66.04,63.5 66.04,0
  pour Top (isolate 0.406): 0,0 0,62.23 64.26,62.23 64.52,62.23 64.52,0
HUMIDITY
  Top 0.305: SV1.2 43.88,31.43 1K.2
  Bottom 0.254: 21.65,28.82 21.6,28.8 21.49,28.69 14.06,28.69 8.69,34.06 8.46,34.06 7.77,34.75 7.77,38.29 8.12,38.63 15.32,38.63 16.12,39.43 20.12,39.43 21.26,38.29 28.12,38.29 28.35,38.52 37.38,38.52 44.12,31.77 SV1.2
N$1
  Bottom 0.305: 28.46,28.12 30.92,25.65 33.53,25.65 34.56,26.68 Y1.1 34.56,31.82 C4.1
N$2
  Bottom 0.305: 28.11,27.77 31.08,24.8 Y1.3 35.65,24.7 C2.1
N$3
  Bottom 0.406: R1.2 29.82,54.52 U$1.RST
N$4
  Bottom 0.305: C5.2 29.12,33.78 28.7,33.78 U3.6 | U3.6
N$5
  Bottom 0.406: R3.2 31.09,51.98 U$1.CLK
N$6
  Bottom 0.406: C7.1 45.21,42.67 44.96,42.42 44.13,42.42 R4.2 45.47,44.26 45.47,50.29 43.8,51.96 U$1.DATA
N$7
  Top 0.305: R10.1 X2.3 5.08,52.58 5.08,57.02 4.19,57.91 X1.3
N$8
  Top 0.305: C12.1 8.37,49.13 R10.2 R9.1
N$9
  Bottom 0.305: Q1.3 R6.1
N$10
  Bottom 0.305: Q2.3 R8.1
N$11
  Bottom 0.406: 5VREG.1 JP1.2
N$12
  Bottom 0.254: FB1.1 32,6.74 U2.5
N$13
  Bottom 0.406: U1.P$11 55.23,17.67 56.9,16 56.9,14.73 U$8.P$3 58.17,13.46 56.9,12.19 56.9,6.6 57.15,6.35 U$20.P$3
N$14
  Top 0.813: JP1.1 3.56,33.27 4.83,33.27 5.84,32.26 5.84,5.33 X3.2
RESET
  Bottom 0.305: 29.5,29.17 29.71,28.96 29.97,28.96 30.48,29.46 31.5,29.46 31.59,29.37 R2.1
RF_ANTENNA
  Top 0.254: IC1.60 37.6,11.43 37.26,11.43 30.63,18.06 17.83,18.06 11.09,24.8 11.09,46.06 13.03,48.01 13.03,48.35 C13.1
  Top 0.305: R9.2 13.17,51.54 C13.1
RSTSIM  (via drill 0.61)
  Top 0.254: v21.95,50.29 12,40.35 12,27.43 16.8,22.63 16.8,22.4 IC1.33
  Bottom 0.254: v21.95,50.29 22.52,50.29 23.09,50.86 23.09,51.32 24.12,52.35 D1.1
  Bottom 0.406: 24.13,52.58 24.15,52.58 D1.1 25.91,52.51 R1.1
RX
  Bottom 0.406: U1.P$10 36.41,17.67 D3.A 36.31,20.27 R13.2
RX_5V
  Bottom 0.305: 27.76,27.42 32.77,22.42 32.77,18.8 34.29,17.27 D3.C
RXSIM  (via drill 0.6)
  Top 0.305: IC1.10 36.32,27.32 36.32,26.92 29.59,20.19 29.59,19.56 28.7,18.67 26.54,18.67 v26.29,19.05
  Bottom 0.305: 26.71,26.38 26.71,25.32 25.78,24.38 25.78,22.73 R5.1 25.53,22.04 25.53,20.95 27.11,19.37 Q1.2 26.59,18.63 v26.29,19.05
TX
  Bottom 0.305: 27.41,27.07 32.26,22.23 32.26,17.78 33.87,16.17 U1.P$9
TXSIM  (via drill 0.6)
  Top 0.305: IC1.9 30.61,20.19 v30.61,19.81
  Bottom 0.305: 27.06,26.73 27.12,26.73 27.69,26.16 27.69,24.38 R7.1 27.78,23.71 27.69,23.62 27.69,22.73 v30.61,19.81 | v30.61,19.81 30.61,18.69 Q2.2 30.54,19.75 v30.61,19.81
UVCC  (via drill 0.6)
  Top 0.305: v27.94,35.31 29.97,33.27 v29.97,32.77
  Bottom 0.305: C6.2 27.34,35.21 U3.2 27.18,35.05 27.43,35.31 v27.94,35.31 | v29.97,32.77 29.72,33.02 28.7,33.02 28.17,32.49 U3.7
VBAT
  Top 0.254: IC1.55 34.18,7.89 34.75,8.46 IC1.56 34.86,8.46 35.55,9.14 IC1.57
VCCSIM  (via drill 0.61)
  Top 0.254: v16.23,50.98 16.23,49.49 11.54,44.81 11.54,25.03 16.57,20 16.8,20 19.77,22.97 19.77,23.32 18.97,24.12 18.97,24.35 IC1.30
  Bottom 0.254: v16.23,50.98 17.6,52.35 D2.2
  Bottom 0.406: U$1.VCC 34.95,56.81 C3.1 27.6,56.9 21.59,56.9 17.7,53 D2.2
VDDEXT  (via drill 0.6)
  Top 0.305: v25.27,19.68 25.53,19.94 v28.57,19.94 v30.1,21.97 32.26,24.13 32.26,30.35 33.41,31.5 | IC1.15 33.41,31.5 | 33.41,31.5 C8.1
  Bottom 0.305: R5.2 28.64,19.87 | 28.64,19.87 Q2.1 | R7.2 v30.1,21.97 | v28.57,19.94 28.64,20.13 28.64,19.87 | Q1.1 25.27,18.69 v25.27,19.68
VIN  (via drill 0.6, 0.61)
  Top 0.254: v31.32,26.98 31.32,30.06 25.38,36.01 24.57,36.01 v24.51,36.07
  Top 0.305: C11.1 29.34,40.89 28.96,41.27 26.48,41.27 C9.1 25.21,39.75 C10.1 24.51,36.89 v24.51,36.07
  Bottom 0.254: 21.77,30.46 24.8,27.43 24.8,27.09 24.46,26.75 U3.24 | 21.77,30.46 21.26,30.98 U3.34 | v31.32,26.98 30.52,27.77 R2.2 | 21.77,30.46 25.15,33.83 25.15,34.29 24.8,34.63 U3.44
  Bottom 0.305: 24.09,26.38 23.37,25.66 23.37,12.83 | 23.37,12.83 23.37,5.33 26.6,2.1 R12.2 | 29.15,28.82 30.12,27.85 R2.2 | R8.2 R6.2 23.56,12.64 23.37,12.83 | v24.51,36.07 24.43,35.99 24.43,34.93
  Bottom 0.406: C16.1 31.94,3.69 U2.1 31.94,2.86 32,2.79 31.31,2.1 R12.2
XOUT
  Bottom 0.305: 21.65,32.14 20.77,33.02 18.54,33.02 | 18.54,33.02 17.62,33.94 IC2.12 | 18.54,33.02 17.51,31.99 C20.1
YOUT  (via drill 0.6)
  Top 0.305: v19.05,33.78 19.05,34.54 C19.1
  Bottom 0.305: 19.05,34.29 20.2,34.29 22,32.49 | IC2.10 18.54,34.8 19.05,34.29 | 19.05,34.29 v19.05,33.78
ZOUT
  Bottom 0.305: 22.34,32.84 19.81,35.37 19.81,36.07 19.19,36.69 IC2.8 19.05,36.83 20.07,37.85 20.07,38.1 C18.1

### Text on the board
tPlace: EYE TRACK
tNames: 3Calibr | Designed By: Abhishek Pratapa | Austin, Texas